# EasyEDA schematic 01-MCU-USB.json
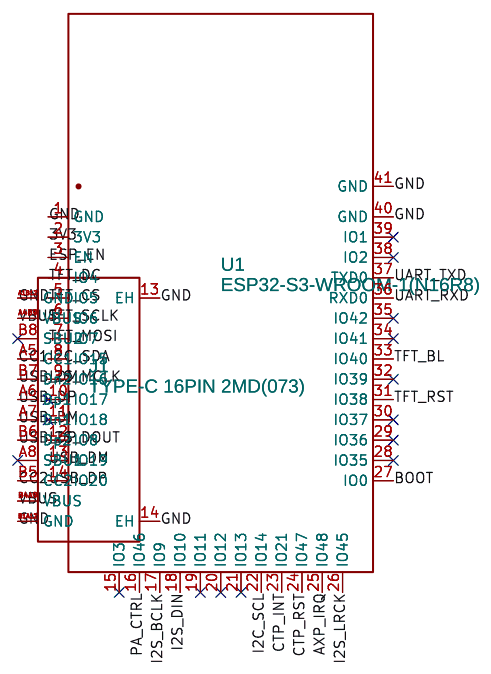
[diagram p0: schematic sheet]

## Parts
J1  TYPE-C 16PIN 2MD(073)  [USB-C-SMD_TYPE-C-16PIN-2MD-073]
U1  ESP32-S3-WROOM-1(N16R8)  [WIRELM-SMD_ESP32-S3-WROOM-1]

## Library data of the parts
J1 = -: Contributor: LCSC; Supplier: LCSC; Supplier Part: C2765186; Manufacturer: SHOU HAN(); JLCPCB Part Class: Extended Part
U1 = -: Contributor: lcsc; Supplier: LCSC; Supplier Part: C2913202; Manufacturer: ESPRESSIF(); Manufacturer Part: ESP32-S3-WROOM-1-N16R8; JLCPCB Part Class: Extended Part

## Nets
3V3: U1.2(3V3)
GND: J1.13(EH) J1.14(EH) J1.A1B12(GND) J1.B1A12(GND) U1.1(GND) U1.40(GND) U1.41(GND)
VBUS: J1.A4B9(VBUS) J1.B4A9(VBUS)
AXP_IRQ: U1.25(IO48)
BOOT: U1.27(IO0)
CC1: J1.A5(CC1)
CC2: J1.B5(CC2)
CTP_INT: U1.23(IO21)
CTP_RST: U1.24(IO47)
ESP_EN: U1.3(EN)
I2C_SCL: U1.22(IO14)
I2C_SDA: U1.8(IO15)
I2S_BCLK: U1.17(IO9)
I2S_DIN: U1.18(IO10)
I2S_DOUT: U1.12(IO8)
I2S_LRCK: U1.26(IO45)
I2S_MCLK: U1.9(IO16)
PA_CTRL: U1.16(IO46)
TFT_BL: U1.33(IO40)
TFT_CS: U1.5(IO5)
TFT_DC: U1.4(IO4)
TFT_MOSI: U1.7(IO7)
TFT_RST: U1.31(IO38)
TFT_SCLK: U1.6(IO6)
UART_RXD: U1.36(RXD0)
UART_TXD: U1.37(TXD0)
USB_DM: J1.A7(Dn1) J1.B7(Dn2) U1.13(IO19)
USB_DP: J1.A6(Dp1) J1.B6(Dp2) U1.14(IO20)

Not connected (* = marked no-connect by the designer): J1 A8(SBU1)* B8(SBU2)*; U1 10(IO17)* 11(IO18)* 15(IO3)* 19(IO11)* 20(IO12)* 21(IO13)* 28(IO35)* 29(IO36)* 30(IO37)* 32(IO39)* 34(IO41)* 35(IO42)* 38(IO2)* 39(IO1)*

## Notes on the sheet
- MEB AI Asistan - 1/5  MCU + USB-C
- Firmware pinleri kilitli. Ayni isimli net etiketleri tum sayfalarda ortaktir.
- IO35/36/37 = octal PSRAM, baglama. Type-C: CC1 ve CC2 ye 5.1k GND (sonraki adimda pasifler).
- U1 ESP32-S3-WROOM-1-N16R8  C2913202    J1 TYPE-C 16P  C2765186
